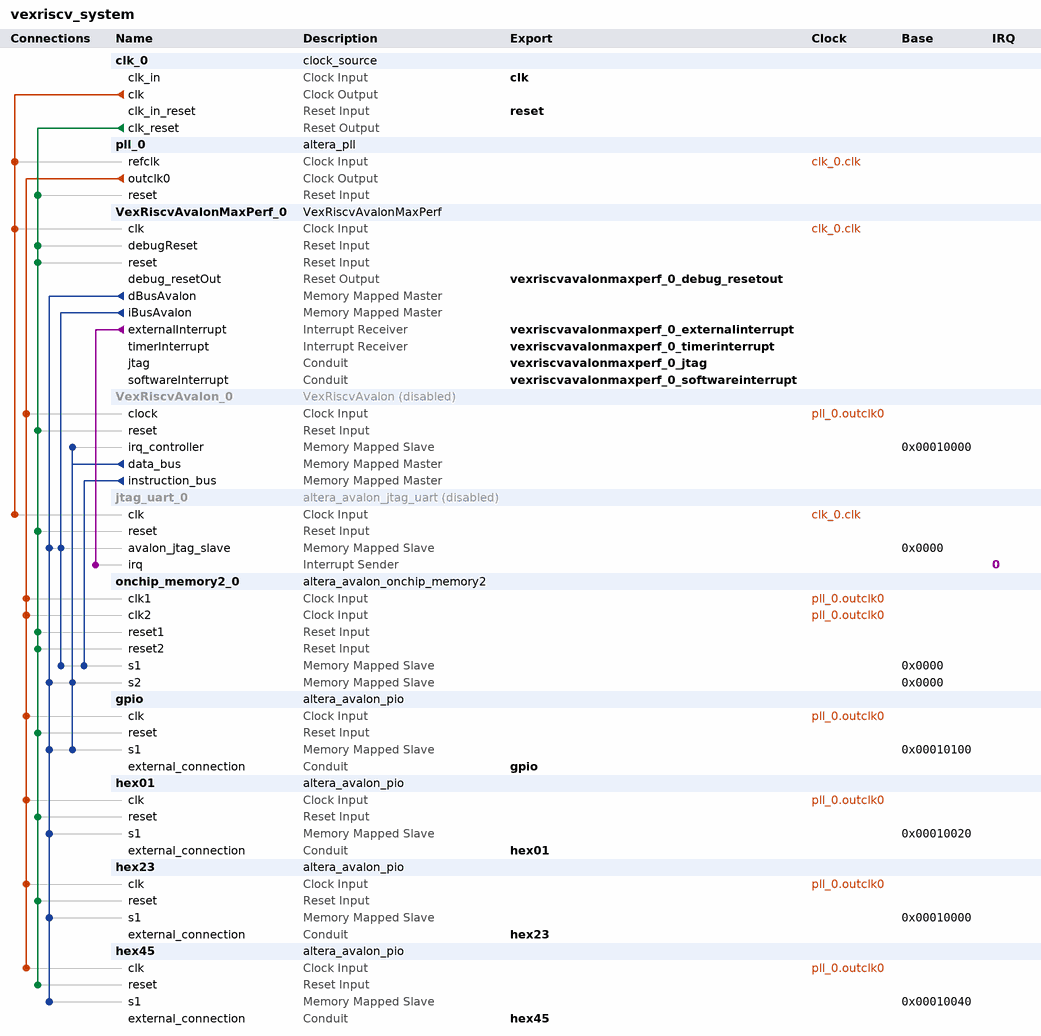
[diagram p0: system contents]
# Platform Designer (Qsys) system vexriscv_system, Cyclone V 5CSEMA5F31C6
# Parameters at their usual value, and those the tool derives, are not listed.
package require -exact qsys 21.1
create_system vexriscv_system
set_project_property DEVICE_FAMILY {Cyclone V}
set_project_property DEVICE 5CSEMA5F31C6

add_instance clk_0 clock_source 21.1
set_instance_parameter_value clk_0 clockFrequency 50000000

add_instance pll_0 altera_pll 21.1
set_instance_parameter_value pll_0 gui_device_speed_grade 1
set_instance_parameter_value pll_0 gui_number_of_clocks 1
set_instance_parameter_value pll_0 gui_operation_mode normal
set_instance_parameter_value pll_0 gui_output_clock_frequency0 50.0
set_instance_parameter_value pll_0 gui_pll_mode {Integer-N PLL}
set_instance_parameter_value pll_0 gui_reference_clock_frequency 50.0
set_instance_parameter_value pll_0 gui_use_locked false

add_instance VexRiscvAvalonMaxPerf_0 VexRiscvAvalonMaxPerf 1.0

add_instance VexRiscvAvalon_0 VexRiscvAvalon 1.0
set_instance_property VexRiscvAvalon_0 ENABLED false
set_instance_parameter_value VexRiscvAvalon_0 CORE_CONFIG 1
set_instance_parameter_value VexRiscvAvalon_0 C_EXCEPTION_VECTOR 32
set_instance_parameter_value VexRiscvAvalon_0 C_IO_BEGIN 2147483648
set_instance_parameter_value VexRiscvAvalon_0 C_IO_END 4294967295
set_instance_parameter_value VexRiscvAvalon_0 C_RESET_VECTOR 16

add_instance jtag_uart_0 altera_avalon_jtag_uart 21.1
set_instance_property jtag_uart_0 ENABLED false
set_instance_parameter_value jtag_uart_0 simInteractiveOptions NO_INTERACTIVE_WINDOWS

add_instance onchip_memory2_0 altera_avalon_onchip_memory2 21.1
set_instance_parameter_value onchip_memory2_0 dataWidth 32
set_instance_parameter_value onchip_memory2_0 dualPort true
set_instance_parameter_value onchip_memory2_0 initMemContent true
set_instance_parameter_value onchip_memory2_0 initializationFileName bootrom.mif
set_instance_parameter_value onchip_memory2_0 memorySize 32786
set_instance_parameter_value onchip_memory2_0 useNonDefaultInitFile true

add_instance gpio altera_avalon_pio 21.1
set_instance_parameter_value gpio bitModifyingOutReg true
set_instance_parameter_value gpio direction Bidir
set_instance_parameter_value gpio simDoTestBenchWiring true
set_instance_parameter_value gpio width 32

add_instance hex01 altera_avalon_pio 21.1
set_instance_parameter_value hex01 bitModifyingOutReg true
set_instance_parameter_value hex01 direction Output
set_instance_parameter_value hex01 width 32

add_instance hex23 altera_avalon_pio 21.1
set_instance_parameter_value hex23 bitModifyingOutReg true
set_instance_parameter_value hex23 direction Output
set_instance_parameter_value hex23 width 32

add_instance hex45 altera_avalon_pio 21.1
set_instance_parameter_value hex45 bitModifyingOutReg true
set_instance_parameter_value hex45 direction Output
set_instance_parameter_value hex45 width 32

# connections
add_connection clk_0.clk jtag_uart_0.clk clock
add_connection clk_0.clk pll_0.refclk clock
add_connection clk_0.clk VexRiscvAvalonMaxPerf_0.clk clock
add_connection pll_0.outclk0 gpio.clk clock
add_connection pll_0.outclk0 hex01.clk clock
add_connection pll_0.outclk0 hex23.clk clock
add_connection pll_0.outclk0 hex45.clk clock
add_connection pll_0.outclk0 onchip_memory2_0.clk1 clock
add_connection pll_0.outclk0 onchip_memory2_0.clk2 clock
add_connection pll_0.outclk0 VexRiscvAvalon_0.clock clock
add_connection clk_0.clk_reset gpio.reset reset
add_connection clk_0.clk_reset hex01.reset reset
add_connection clk_0.clk_reset hex23.reset reset
add_connection clk_0.clk_reset hex45.reset reset
add_connection clk_0.clk_reset jtag_uart_0.reset reset
add_connection clk_0.clk_reset onchip_memory2_0.reset1 reset
add_connection clk_0.clk_reset onchip_memory2_0.reset2 reset
add_connection clk_0.clk_reset pll_0.reset reset
add_connection clk_0.clk_reset VexRiscvAvalon_0.reset reset
add_connection clk_0.clk_reset VexRiscvAvalonMaxPerf_0.debugReset reset
add_connection clk_0.clk_reset VexRiscvAvalonMaxPerf_0.reset reset
add_connection VexRiscvAvalon_0.data_bus gpio.s1 avalon
set_connection_parameter_value VexRiscvAvalon_0.data_bus/gpio.s1 baseAddress 0x00010100
add_connection VexRiscvAvalon_0.data_bus onchip_memory2_0.s2 avalon
set_connection_parameter_value VexRiscvAvalon_0.data_bus/onchip_memory2_0.s2 baseAddress 0x0000
add_connection VexRiscvAvalon_0.data_bus VexRiscvAvalon_0.irq_controller avalon
set_connection_parameter_value VexRiscvAvalon_0.data_bus/VexRiscvAvalon_0.irq_controller baseAddress 0x00010000
add_connection VexRiscvAvalon_0.instruction_bus onchip_memory2_0.s1 avalon
set_connection_parameter_value VexRiscvAvalon_0.instruction_bus/onchip_memory2_0.s1 baseAddress 0x0000
add_connection VexRiscvAvalonMaxPerf_0.dBusAvalon gpio.s1 avalon
set_connection_parameter_value VexRiscvAvalonMaxPerf_0.dBusAvalon/gpio.s1 baseAddress 0x00010100
add_connection VexRiscvAvalonMaxPerf_0.dBusAvalon hex01.s1 avalon
set_connection_parameter_value VexRiscvAvalonMaxPerf_0.dBusAvalon/hex01.s1 baseAddress 0x00010020
add_connection VexRiscvAvalonMaxPerf_0.dBusAvalon hex23.s1 avalon
set_connection_parameter_value VexRiscvAvalonMaxPerf_0.dBusAvalon/hex23.s1 baseAddress 0x00010000
add_connection VexRiscvAvalonMaxPerf_0.dBusAvalon hex45.s1 avalon
set_connection_parameter_value VexRiscvAvalonMaxPerf_0.dBusAvalon/hex45.s1 baseAddress 0x00010040
add_connection VexRiscvAvalonMaxPerf_0.dBusAvalon jtag_uart_0.avalon_jtag_slave avalon
set_connection_parameter_value VexRiscvAvalonMaxPerf_0.dBusAvalon/jtag_uart_0.avalon_jtag_slave baseAddress 0x0000
add_connection VexRiscvAvalonMaxPerf_0.dBusAvalon onchip_memory2_0.s2 avalon
set_connection_parameter_value VexRiscvAvalonMaxPerf_0.dBusAvalon/onchip_memory2_0.s2 baseAddress 0x0000
add_connection VexRiscvAvalonMaxPerf_0.iBusAvalon jtag_uart_0.avalon_jtag_slave avalon
set_connection_parameter_value VexRiscvAvalonMaxPerf_0.iBusAvalon/jtag_uart_0.avalon_jtag_slave baseAddress 0x0000
add_connection VexRiscvAvalonMaxPerf_0.iBusAvalon onchip_memory2_0.s1 avalon
set_connection_parameter_value VexRiscvAvalonMaxPerf_0.iBusAvalon/onchip_memory2_0.s1 baseAddress 0x0000
add_connection VexRiscvAvalonMaxPerf_0.externalInterrupt jtag_uart_0.irq interrupt
set_connection_parameter_value VexRiscvAvalonMaxPerf_0.externalInterrupt/jtag_uart_0.irq irqNumber 0

# exported interfaces
add_interface clk clock sink
set_interface_property clk EXPORT_OF clk_0.clk_in
add_interface gpio conduit end
set_interface_property gpio EXPORT_OF gpio.external_connection
add_interface hex01 conduit end
set_interface_property hex01 EXPORT_OF hex01.external_connection
add_interface hex23 conduit end
set_interface_property hex23 EXPORT_OF hex23.external_connection
add_interface hex45 conduit end
set_interface_property hex45 EXPORT_OF hex45.external_connection
add_interface reset reset sink
set_interface_property reset EXPORT_OF clk_0.clk_in_reset
add_interface vexriscvavalonmaxperf_0_debug_resetout reset source
set_interface_property vexriscvavalonmaxperf_0_debug_resetout EXPORT_OF VexRiscvAvalonMaxPerf_0.debug_resetOut
add_interface vexriscvavalonmaxperf_0_externalinterrupt interrupt receiver
set_interface_property vexriscvavalonmaxperf_0_externalinterrupt EXPORT_OF VexRiscvAvalonMaxPerf_0.externalInterrupt
add_interface vexriscvavalonmaxperf_0_jtag conduit end
set_interface_property vexriscvavalonmaxperf_0_jtag EXPORT_OF VexRiscvAvalonMaxPerf_0.jtag
add_interface vexriscvavalonmaxperf_0_softwareinterrupt conduit end
set_interface_property vexriscvavalonmaxperf_0_softwareinterrupt EXPORT_OF VexRiscvAvalonMaxPerf_0.softwareInterrupt
add_interface vexriscvavalonmaxperf_0_timerinterrupt interrupt receiver
set_interface_property vexriscvavalonmaxperf_0_timerinterrupt EXPORT_OF VexRiscvAvalonMaxPerf_0.timerInterrupt

set_interconnect_requirement {$system} qsys_mm.clockCrossingAdapter HANDSHAKE
set_interconnect_requirement {$system} qsys_mm.enableEccProtection FALSE
set_interconnect_requirement {$system} qsys_mm.insertDefaultSlave FALSE
set_interconnect_requirement {$system} qsys_mm.maxAdditionalLatency 1

save_system vexriscv_system.qsys
